# Altium schematic sheet FPGA_MIO.SchDoc: TE0722
size A4; Organization: Trenz Electronic GmbH; DocumentNumber: 4; Revision: 01; SheetNumber: 4; SheetTotal: 8; Date: 07.11.2014; PageSetup: Record=PageOptions|CenterHorizontal=True|CenterVertical=True|PrintScale=0.96|XCorrection=1.00|YCorrection=1.00|PrintKind=0|BorderSize=5000000|LeftOffset=0|BottomOffset=0|Orientation=2|PaperLength=1000|PaperWidth=1000|Scale=100|PaperSource=7|PrintQuality=-4|MediaType=1|DitherType=10|PaperKind=A4|PrintScaleMode=1
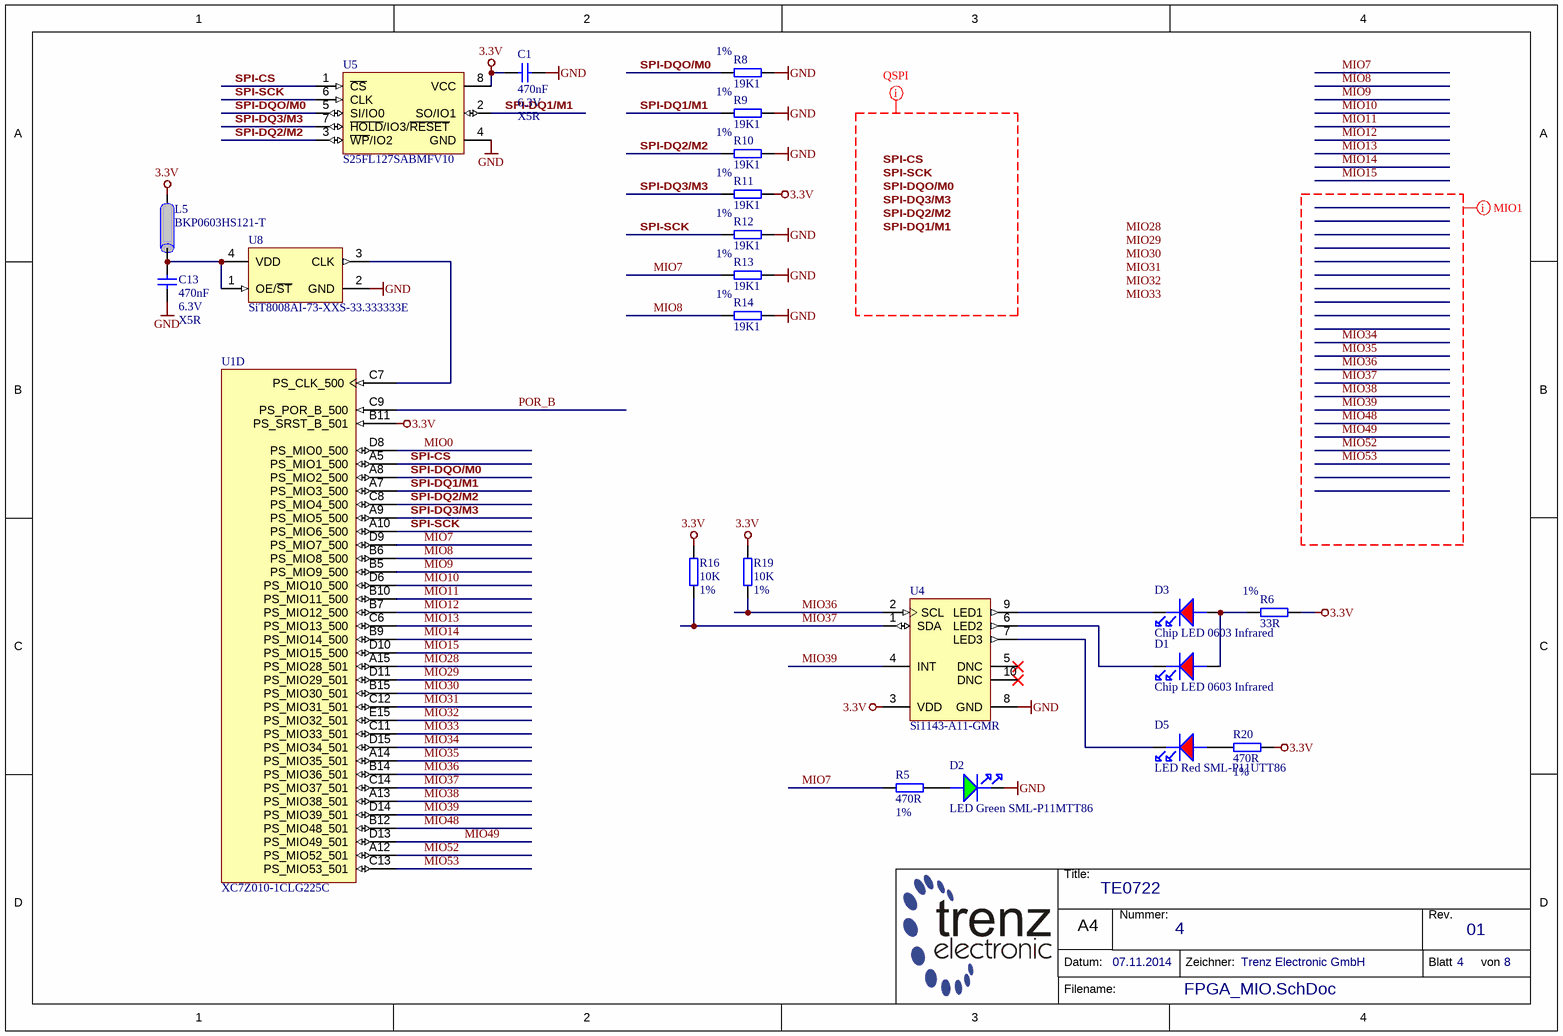
[diagram p0: FPGA_MIO.SchDoc]

## Parts
C1  470nF  Voltage: 6.3V  Technology: X5R  [CAPC0603X33N]
C13  470nF  Voltage: 6.3V  Technology: X5R  [CAPC0603X33N]
D1  Chip LED 0603 Infrared  [chipLED_0603_Red]
D2  LED Green SML-P11MTT86  [LEDC1006X25N_GREEN]
D3  Chip LED 0603 Infrared  [chipLED_0603_Red]
D5  LED Red SML-P11UTT86  [LEDC1006X25N_RED]
L5  BKP0603HS121-T  [INDC0603X33N]
R5  470R  Tolerance: 1%  [RESC1005X40N]
R6  33R  Tolerance: 1%  [RESC1005X40N]
R8  19K1  Tolerance: 1%  [RESC0603X26N]
R9  19K1  Tolerance: 1%  [RESC0603X26N]
R10  19K1  Tolerance: 1%  [RESC0603X26N]
R11  19K1  Tolerance: 1%  [RESC0603X26N]
R12  19K1  Tolerance: 1%  [RESC0603X26N]
R13  19K1  Tolerance: 1%  [RESC0603X26N]
R14  19K1  Tolerance: 1%  [RESC0603X26N]
R16  10K  Tolerance: 1%  [RESC0603X26N]
R19  10K  Tolerance: 1%  [RESC0603X26N]
R20  470R  Tolerance: 1%  [RESC1005X40N]
U1  XC7Z010-1CLG225C  [CLG225]  (part D of 8)
U4  Si1143-A11-GMR  [QFN50P200X200X75-10N]
U5  S25FL127SABMFV10  [SOIC127P790X216-8N]
U8  SiT8008AI-73-XXS-33.333333E  [2016]

## Nets
3.3V: C1.1 L5.1 R6.2 R11.2 R16.2 R19.2 R20.1 U1.B11(PS_SRST_B_501) U4.3(VDD) U5.8(VCC)
GND: C1.2 C13.2 D2.K R8.2 R9.2 R10.2 R12.2 R13.2 R14.2 U4.8(GND) U5.4(GND) U8.2(GND)
MIO0: U1.D8(PS_MIO0_500)
MIO7: R5.2 R13.1 U1.D9(PS_MIO7_500)
MIO8: R14.1 U1.B6(PS_MIO8_500)
MIO9: U1.B5(PS_MIO9_500)
MIO10: U1.D6(PS_MIO10_500)
MIO11: U1.B10(PS_MIO11_500)
MIO12: U1.B7(PS_MIO12_500)
MIO13: U1.C6(PS_MIO13_500)
MIO14: U1.B9(PS_MIO14_500)
MIO15: U1.D10(PS_MIO15_500)
MIO28: U1.A15(PS_MIO28_501)
MIO29: U1.D11(PS_MIO29_501)
MIO30: U1.B15(PS_MIO30_501)
MIO31: U1.C12(PS_MIO31_501)
MIO32: U1.E15(PS_MIO32_501)
MIO33: U1.C11(PS_MIO33_501)
MIO34: U1.D15(PS_MIO34_501)
MIO35: U1.A14(PS_MIO35_501)
MIO36: R19.1 U1.B14(PS_MIO36_501) U4.2(SCL)
MIO37: R16.1 U1.C14(PS_MIO37_501) U4.1(SDA)
MIO38: U1.A13(PS_MIO38_501)
MIO39: U1.D14(PS_MIO39_501) U4.4(INT)
MIO48: U1.B12(PS_MIO48_501)
MIO49: U1.D13(PS_MIO49_501)
MIO52: U1.A12(PS_MIO52_501)
MIO53: U1.C13(PS_MIO53_501)
POR_B: U1.C9(PS_POR_B_500)
SPI-CS: U1.A5(PS_MIO1_500) U5.1(~{CS})
SPI-DQ1/M1: R9.1 U1.A7(PS_MIO3_500) U5.2(SO/IO1)
SPI-DQ2/M2: R10.1 U1.C8(PS_MIO4_500) U5.3(~{WP}/IO2)
SPI-DQ3/M3: R11.1 U1.A9(PS_MIO5_500) U5.7(~{HOLD}/IO3/~{RESET})
SPI-DQO/M0: R8.1 U1.A8(PS_MIO2_500) U5.5(SI/IO0)
SPI-SCK: R12.1 U1.A10(PS_MIO6_500) U5.6(CLK)
NetC13_1: C13.1 L5.2 U8.1(OE/~{ST}) U8.4(VDD)
NetD1_A: D1.A D3.A R6.1
NetD1_K: D1.K U4.6(LED2)
NetD2_A: D2.A R5.1
NetD3_K: D3.K U4.9(LED1)
NetD5_A: D5.A R20.2
NetD5_K: D5.K U4.7(LED3)
NetU1_C7: U1.C7(PS_CLK_500) U8.3(CLK)

Not connected (* = marked no-connect by the designer): U4 5(DNC)* 10(DNC)*

## Layout directives
net class MIO1: MIO34, MIO35, MIO36, MIO37, MIO38, MIO39, MIO48, MIO49, MIO52, MIO53
net class QSPI: SPI-CS, SPI-DQ1/M1, SPI-DQ2/M2, SPI-DQ3/M3, SPI-DQO/M0, SPI-SCK

## Notes on the sheet
- Labels drawn without touching a wire or pin: MIO28, MIO29, MIO30, MIO31, MIO32, MIO33, SPI-CS, SPI-DQ1/M1, SPI-DQ2/M2, SPI-DQ3/M3, SPI-DQO/M0, SPI-SCK
- Title:
- Nummer:
- Rev.
- Datum:
- A4
- Zeichner:
- Blatt
- von
- Filename:

## Library data of the parts
C1 C13 = 24921: KON 470nF X5R 6.3V SMD 20%; AN: 24921; Value: 470n; Mixed: SMT; Preferred: Yes; Case: 0603 (0201); Tolerance: 20%
D1 D3 = 26721: AN: 26721; Voltage: 1.2; Mixed: SMT; Preferred: Yes; Case: 0603; HelpURL: B:\AD\adlib\datasheet\APT1608F3C
D2 = 24211: LED Grün SML-P11MTT86 SMD; AN: 24211; Mixed: SMT; Preferred: Yes; Case: 1005 (0402); HelpURL: B:\AD\adlib\datasheet\SML-P1
D5 = 24212: LED Rot SML-P11UTT86 SMD; AN: 24212; Mixed: SMT; Preferred: Yes; Case: 1005 (0402); HelpURL: B:\AD\adlib\datasheet\SML-P1
L5 = 25393: Ferritdurchführung SMD 0201; AN: 25393; Trenz-Stock: Yes; Mixed: SMT; Tolerance: 25%; Case: 0603 (0201); HelpURL: B:\AD\adlib\datasheet\MULTILAYER CHIP BEAD INDUCTORS BK; Preferred: Yes
R5 R20 = 22769: WID SMD 470R 1% 0,063W; AN: 22769; Value: 470; Mixed: SMT; Preferred: Yes; Case: 1005 (0402)
R6 = 22770: WID SMD 33R 1% 0,063W; AN: 22770; Mixed: SMT; Value: 33; Preferred: Yes; Case: 1005 (0402)
R8-R14 = 25053: WID SMD 19K1 1% 0,05W; AN: 25053; Mixed: SMT; Value: 19.1K; Case: 0603 (0201); HelpURL: B:\AD\adlib\datasheet\R0201
R16 R19 = 24914: WID SMD 10K 1% 0,05W; AN: 24914; Mixed: SMT; Preferred: Yes; Case: 0603 (0201); Value: 10K; HelpURL: B:\AD\adlib\datasheet\R0201
U1 = 26308: AN: 26308; Mixed: SMT; Case: CLG225; HelpURL: B:\AD\adlib\datasheet\XC7\Zynq
U4 = 26318: AN: 26318; Mixed: AMT; Case: QFN10; HelpURL: B:\AD\adlib\datasheet\Si1141x
U5 = 26078: S25FL127SABMFV10 automotive SO8; AN: 26078; Mixed: SMT; Case: SO8W; HelpURL: B:\AD\adlib\datasheet\S25FL12xS
U8 = 25023: SiT8008AI-73-XXS-33.333333E MEMS Oszillator 33.333333MHz; AN: 25023; Value: 33M; Trenz-Stock: Yes; Mixed: SMT; Case: 2.0  x 1.6mm; HelpURL: B:\AD\adlib\datasheet\SiT8008; Preferred: Yes